# EAGLE design inverter-adc-demo (EAGLE 9.6.1)
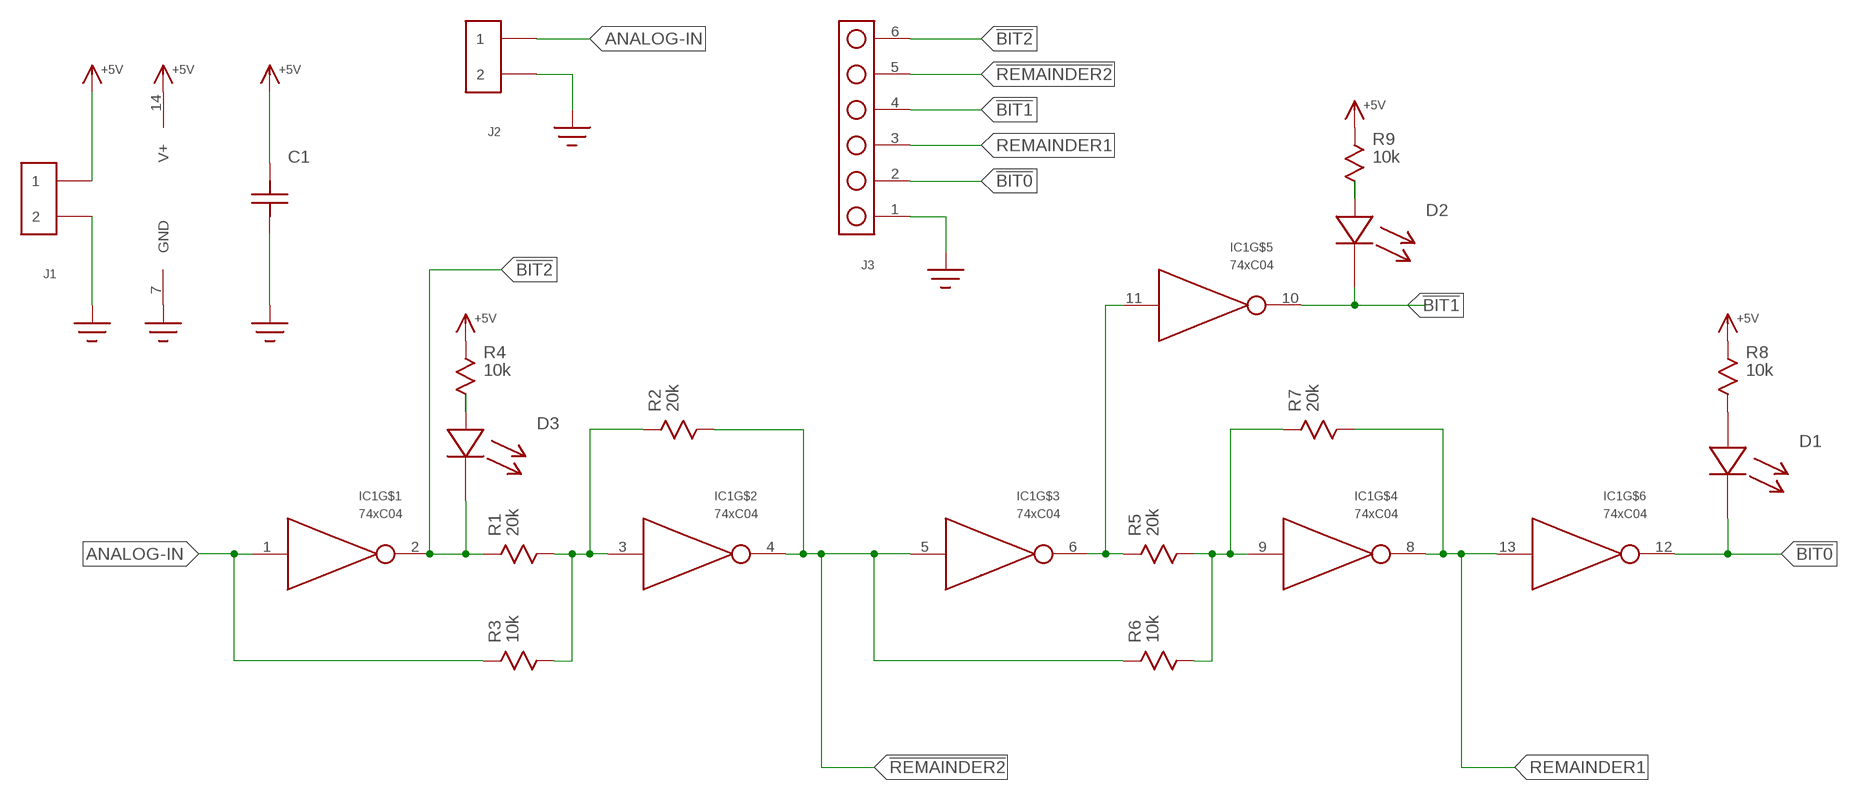
[diagram p0: schematic, sheet 1]

## Parts
C1  C100MIL  [C-100MIL]
D1  LED5MM  [LED-5MM]
D2  LED5MM  [LED-5MM]
D3  LED5MM  [LED-5MM]
IC1  74xC04  74XX04DIP  [DIP14]
J1  HEADER_2PIN  [HEADER_2PIN]
J2  HEADER_2PIN  [HEADER_2PIN]
J3  HEADER_6PIN  [HEADER_6PIN]
R1  20k  RTH-0.25W  [R-0.25W]
R2  20k  RTH-0.25W  [R-0.25W]
R3  10k  RTH-0.25W  [R-0.25W]
R4  10k  RTH-0.25W  [R-0.25W]
R5  20k  RTH-0.25W  [R-0.25W]
R6  10k  RTH-0.25W  [R-0.25W]
R7  20k  RTH-0.25W  [R-0.25W]
R8  10k  RTH-0.25W  [R-0.25W]
R9  10k  RTH-0.25W  [R-0.25W]

## Nets
!BIT0!: D1.C IC1.12(OUT) J3.2
!BIT1!: D2.C IC1.10(OUT) J3.4
!BIT2!: D3.C IC1.2(OUT) J3.6 R1.P$1
!REMAINDER2!: IC1.4(OUT) IC1.5(IN) J3.5 R2.P$2 R6.P$1
+5V: C1.P$2 IC1.14(V+) J1.1 R4.P$1 R8.P$1 R9.P$1
ANALOG-IN: IC1.1(IN) J2.1 R3.P$1
GND: C1.P$1 IC1.7(GND) J1.2 J2.2 J3.1
N$2: IC1.3(IN) R1.P$2 R2.P$1 R3.P$2
N$5: IC1.6(OUT) IC1.11(IN) R5.P$1
N$6: IC1.9(IN) R5.P$2 R6.P$2 R7.P$1
N$9: D3.A R4.P$2
N$11: D1.A R8.P$2
N$13: D2.A R9.P$2
REMAINDER1: IC1.8(OUT) IC1.13(IN) J3.3 R7.P$2

## Library data of the parts
C1 = yapo:C
D1-D3 = yapo:LED
IC1 = yapo:74XX04
J1 J2 = yapo:HEADER_2PIN
J3 = yapo:HEADER_6PIN
R1-R9 = yapo:R

## Board
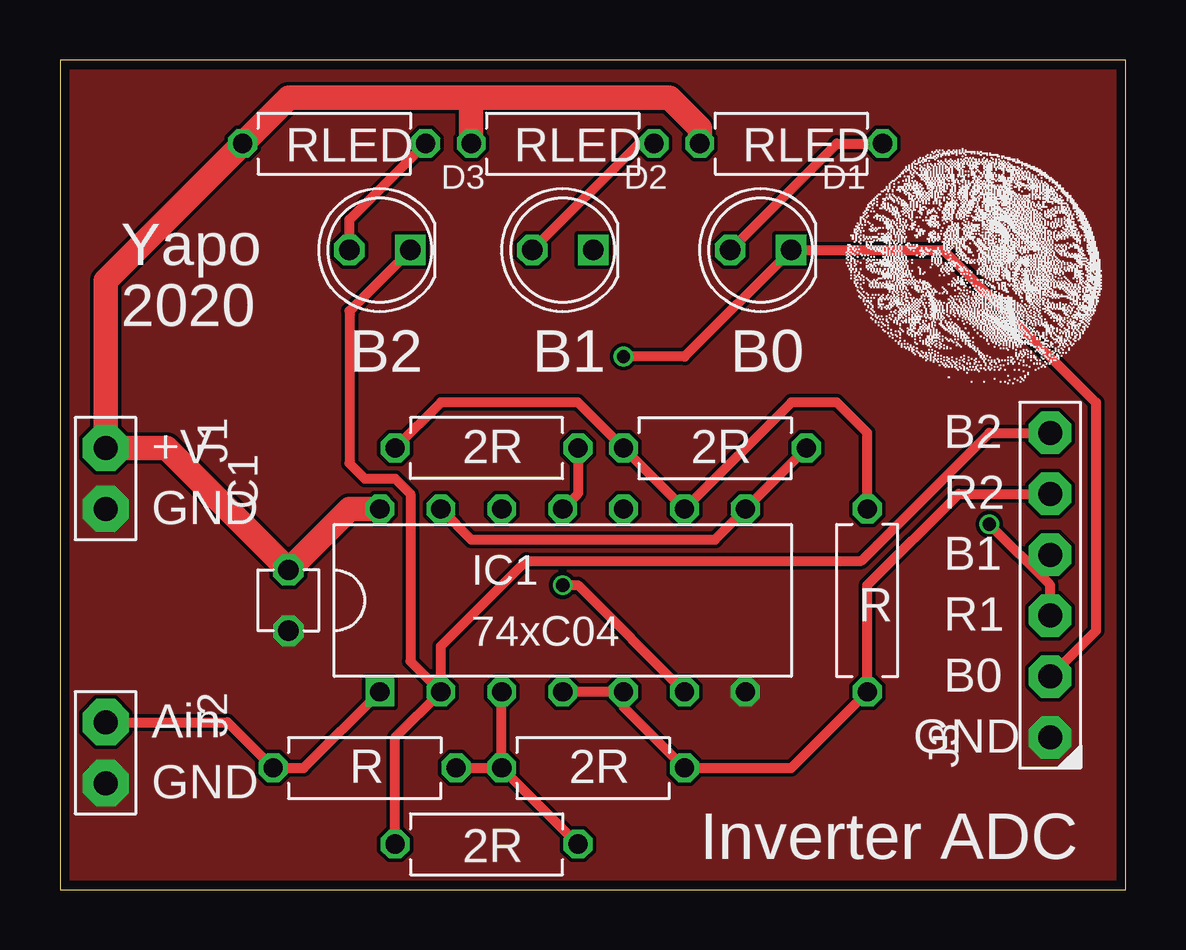
[diagram p1: board, top side]
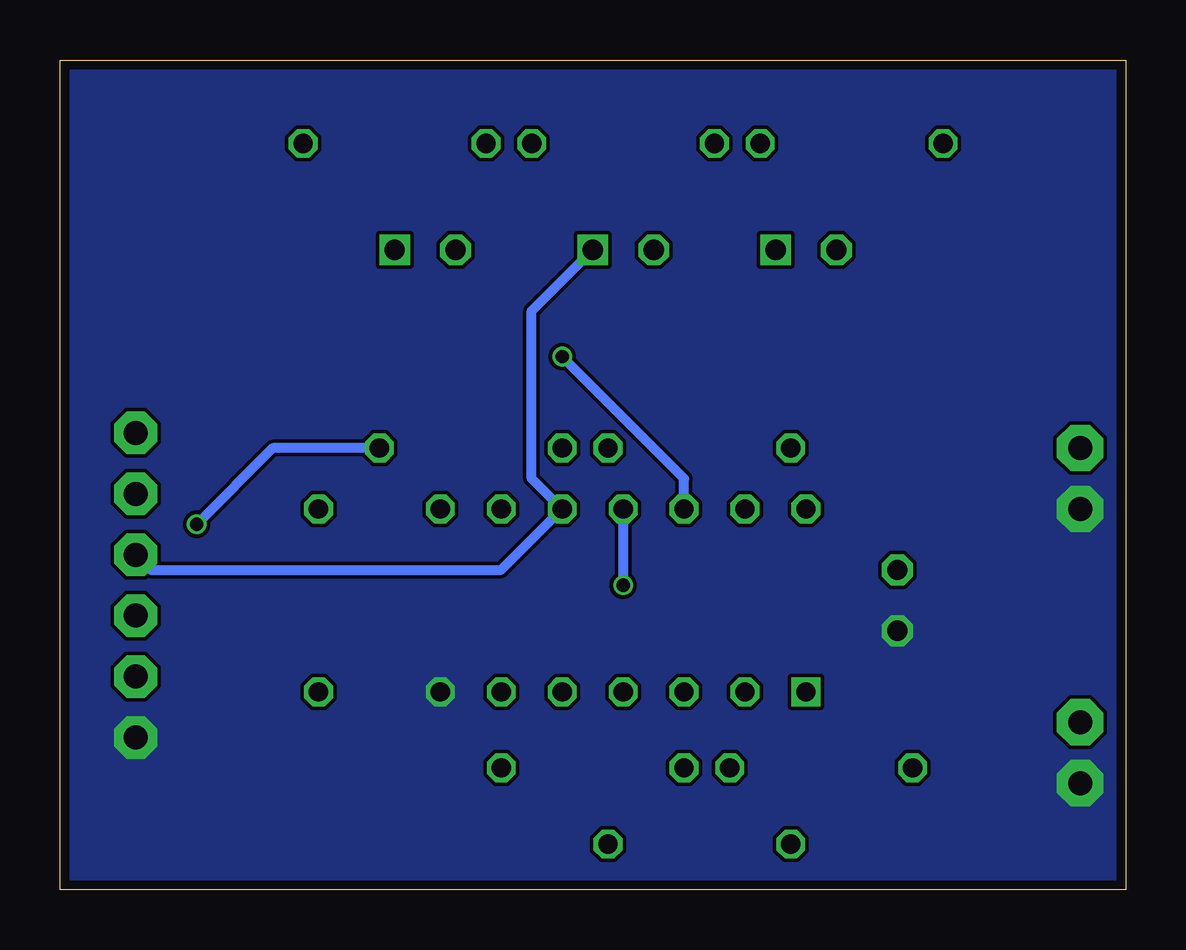
[diagram p2: board, bottom side, seen from below]

Size 44.43 x 34.59 mm. Coordinates in mm from the lower left corner, seen from the top.
Outline: 0,0 44.43,0 44.43,34.59 0,34.59 0,0
Copper layers (1*16): Top 0.035559375mm / dielectric 1.6mm / Bottom 0.035559375mm
Design rules "oshpark-2layer": minimum track width 6mil, minimum drill 10mil, track to track 6mil, track to pad 6mil, pad to pad 6mil, via to via 6mil, smd to smd 6mil, copper to edge 15mil, drill to drill 6mil, minimum pad ring 5mil, minimum via ring 5mil, stop-mask expansion 2.5mil, vias tented up to drill 0mil, thermal gap 10mil

### Footprints (pad centres in the part's own frame; a part is rotated, then mirrored left to right if it is on the bottom)
C-100MIL = drill 0.85 octagon: P$1 -1.27,0; P$2 1.27,0
LED-5MM = drill 0.85 octagon: A -1.27,0 | drill 0.85 square: C 1.27,0
DIP14 = drill 0.8 square: 1 -7.62,-3.81 | drill 0.8 octagon: 2 -5.08,-3.81; 3 -2.54,-3.81; 4 0,-3.81; 5 2.54,-3.81; 6 5.08,-3.81; 7 7.62,-3.81; 8 7.62,3.81; 9 5.08,3.81; 10 2.54,3.81; 11 0,3.81; 12 -2.54,3.81; 13 -5.08,3.81; 14 -7.62,3.81
HEADER_2PIN = drill 1 pad 1.93 octagon: 1 -1.27,0; 2 1.27,0
HEADER_6PIN = drill 1 pad 1.778 octagon: 1 -6.35,0; 2 -3.81,0; 3 -1.27,0; 4 1.27,0; 5 3.81,0; 6 6.35,0
R-0.25W = drill 0.8 octagon: P$1 -3.81,0; P$2 3.81,0

### Placement (x,y rotation side)
C1  9.53,12.06 90 top
D1  29.21,26.67 0 top
D2  20.95,26.67 0 top
D3  13.34,26.67 0 top
IC1  20.95,12.06 0 top
J1  1.91,17.14 270 top
J2  1.91,5.71 270 top
J3  41.27,12.7 90 top
R1  17.78,1.91 0 top
R2  22.23,5.08 0 top
R3  12.7,5.08 0 top
R4  11.43,31.11 0 top
R5  17.78,18.41 180 top
R6  33.66,12.06 90 top
R7  27.3,18.41 0 top
R8  30.48,31.11 0 top
R9  20.95,31.11 0 top

### Tracks (layer width: path | path; a pad name or v marks a point on that pad's centre or on a via)
!BIT0!  (via drill 0.55)
  Top 0.406: v23.5,22.23 26.04,22.23 D1.C 36.83,26.67 43.18,20.32 43.18,10.79 J3.2
  Bottom 0.406: IC1.12 18.41,17.14 v23.5,22.23
!BIT1!
  Bottom 0.406: D2.C 24.77,24.13 24.77,17.14 IC1.10 26.04,13.34 40.64,13.34 J3.4
!BIT2!
  Top 0.406: R1.P$1 13.97,6.35 IC1.2 | D3.C 12.06,24.13 12.06,17.78 12.7,17.14 13.97,17.14 14.61,16.51 14.61,9.53 IC1.2 | IC1.2 15.88,10.16 19.43,13.72 33.4,13.72 38.73,19.05 J3.6
!REMAINDER2!
  Top 0.406: IC1.4 IC1.5 23.5,7.62 R2.P$2 30.48,5.08 R6.P$1 33.66,12.7 37.47,16.51 J3.5
+5V
  Top 1.016: IC1.14 12.06,15.88 C1.P$2 4.45,18.41 J1.1 1.91,25.4 R4.P$1 9.53,33.02 17.14,33.02 | 17.14,33.02 25.4,33.02 26.67,31.75 R8.P$1 | R9.P$1 17.14,33.02
ANALOG-IN
  Top 0.406: J2.1 6.99,6.99 R3.P$1 10.16,5.08 IC1.1
GND
  pour Top (no thermals): -4.45,38.1 50.16,38.1 50.16,-5.08 -4.45,-5.08
  pour Bottom (no thermals): -8.89,41.91 53.34,41.91 53.34,-9.53 -8.89,-9.53
N$2
  Top 0.406: R3.P$2 R2.P$1 | R2.P$1 IC1.3 | R2.P$1 R1.P$2
N$5  (via drill 0.55)
  Top 0.406: IC1.11 21.59,16.51 R5.P$1 | v20.95,12.7 21.59,12.7 IC1.6
  Bottom 0.406: IC1.11 v20.95,12.7
N$6
  Top 0.406: R5.P$2 15.88,20.32 21.59,20.32 R7.P$1 IC1.9 30.48,20.32 32.38,20.32 33.66,19.05 R6.P$2
N$9
  Top 0.406: D3.A 12.06,27.94 R4.P$2
N$11
  Top 0.406: D1.A 32.38,31.11 R8.P$2
N$13
  Top 0.406: D2.A 24.13,31.11 R9.P$2
REMAINDER1  (via drill 0.55)
  Top 0.406: R7.P$2 IC1.8 27.3,14.61 17.14,14.61 IC1.13 | J3.3 41.27,12.7 v38.73,15.24
  Bottom 0.406: R7.P$2 35.56,18.41 v38.73,15.24

### Text on the board
tPlace: RLED | RLED | RLED | Yapo | 2020 | B2 | B1 | B0 | +V | 2R | 2R | B2 | R2 | GND | B1 | R | R1 | B0 | Ain | GND | GND | R | 2R | 2R | Inverter ADC